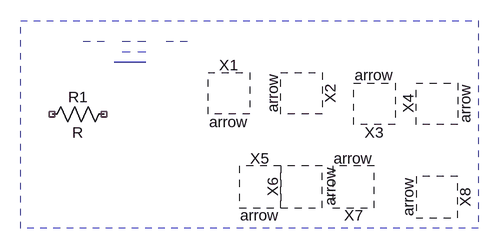
[diagram p0: schematic Lines.asc]
Lines.asc, the LTspice schematic file:
Version 4
SHEET 1 880 680
SYMBOL res -112 192 R270
WINDOW 0 27 56 VTop 2
WINDOW 3 3 56 VBottom 2
SYMATTR InstName R1
SYMBOL TCLib\\Special\\arrow 176 144 R0
SYMATTR InstName X1
SYMBOL TCLib\\Special\\arrow 288 144 R90
SYMATTR InstName X2
SYMBOL TCLib\\Special\\arrow 400 160 R180
SYMATTR InstName X3
SYMBOL TCLib\\Special\\arrow 496 160 R270
SYMATTR InstName X4
SYMBOL TCLib\\Special\\arrow 224 288 M0
SYMATTR InstName X5
SYMBOL TCLib\\Special\\arrow 288 288 M90
SYMATTR InstName X6
SYMBOL TCLib\\Special\\arrow 368 288 M180
SYMATTR InstName X7
SYMBOL TCLib\\Special\\arrow 496 304 M270
SYMATTR InstName X8
LINE Normal 48 64 0 64 2
LINE Normal 48 80 0 80 1
LINE Normal 48 96 0 96
LINE Normal 112 64 80 64 2
LINE Normal -16 64 -48 64 2
RECTANGLE Normal 560 352 -144 32 2

The netlist it stands for:
* Lines.asc
R1 NC_01 NC_02 R
* X1: arrow (symbol TCLib\Special\arrow not available, pin order unknown); nets seen at it: 
* X2: arrow (symbol TCLib\Special\arrow not available, pin order unknown); nets seen at it: 
* X3: arrow (symbol TCLib\Special\arrow not available, pin order unknown); nets seen at it: 
* X4: arrow (symbol TCLib\Special\arrow not available, pin order unknown); nets seen at it: 
* X5: arrow (symbol TCLib\Special\arrow not available, pin order unknown); nets seen at it: 
* X6: arrow (symbol TCLib\Special\arrow not available, pin order unknown); nets seen at it: 
* X7: arrow (symbol TCLib\Special\arrow not available, pin order unknown); nets seen at it: 
* X8: arrow (symbol TCLib\Special\arrow not available, pin order unknown); nets seen at it: 
.backanno
.end